# Altium schematic sheet UWB_F4_MCU.SchDoc
size A1; Organization: Altium Limited; Address1: L3, 12a Rodborough Rd; Address2: Frenchs Forest; Address3: NSW; Address4: Australia 2086
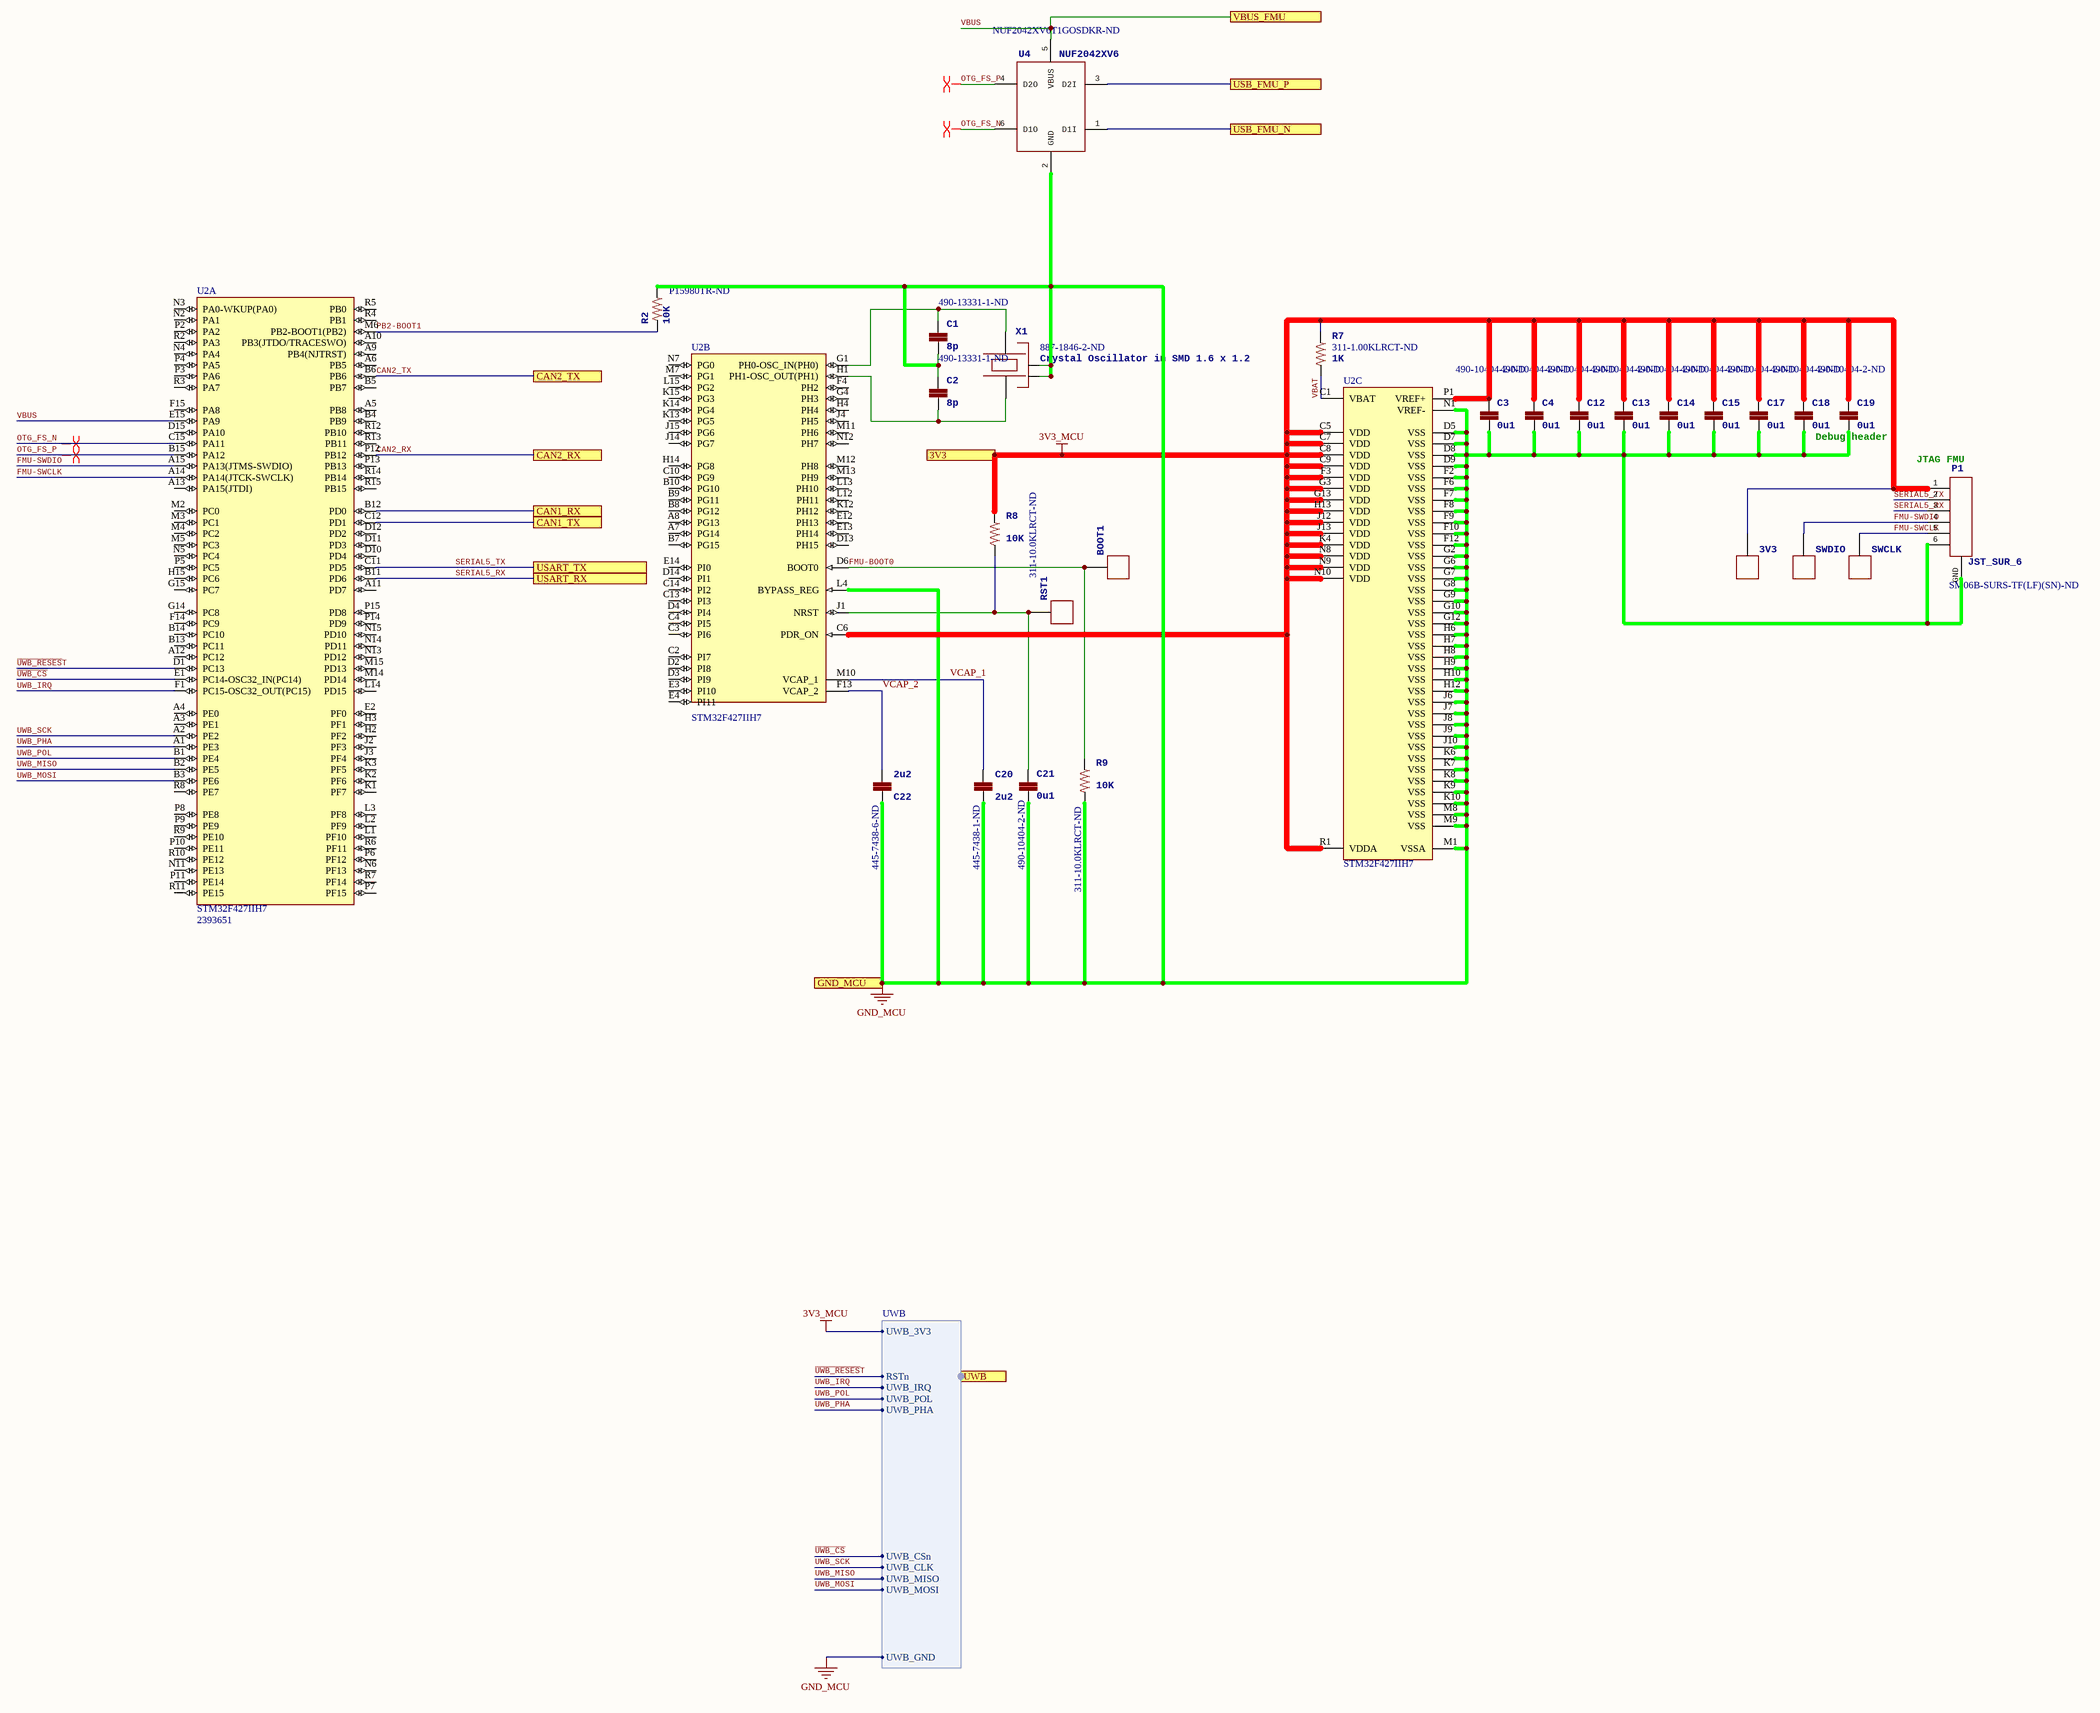
[diagram p0: UWB_F4_MCU.SchDoc]

## Parts
3V3  (no value)  [PAD.04X.04]  (no BOM)
BOOT1  (no value)  [PAD.04X.04]  (no BOM)
C1  8p  Supplier Part Number 1: 490-13331-1-ND  [0201-cap]
C2  8p  Supplier Part Number 1: 490-13331-1-ND  [0201-cap]
C3  0u1  Supplier Part Number 1: 490-10404-2-ND  [0201-cap]
C4  0u1  Supplier Part Number 1: 490-10404-2-ND  [0201-cap]
C12  0u1  Supplier Part Number 1: 490-10404-2-ND  [0201-cap]
C13  0u1  Supplier Part Number 1: 490-10404-2-ND  [0201-cap]
C14  0u1  Supplier Part Number 1: 490-10404-2-ND  [0201-cap]
C15  0u1  Supplier Part Number 1: 490-10404-2-ND  [0201-cap]
C17  0u1  Supplier Part Number 1: 490-10404-2-ND  [0201-cap]
C18  0u1  Supplier Part Number 1: 490-10404-2-ND  [0201-cap]
C19  0u1  Supplier Part Number 1: 490-10404-2-ND  [0201-cap]
C20  2u2  Supplier Part Number 1: 445-7438-1-ND  [0603-CAP]
C21  0u1  Supplier Part Number 1: 490-10404-2-ND  [0201-cap]
C22  2u2  Supplier Part Number 1: 445-7438-6-ND  [0603-CAP]
P1  JST_SUR_6  Supplier Part Number 1: SM06B-SURS-TF(LF)(SN)-ND  [JST_SUR_H6]
R2  10K  Supplier Part Number 1: P15980TR-ND  [0201-RES]
R7  1K  Supplier Part Number 1: 311-1.00KLRCT-ND  [0402-RES]
R8  10K  Supplier Part Number 1: 311-10.0KLRCT-ND  [0402-RES]
R9  10K  Supplier Part Number 1: 311-10.0KLRCT-ND  [0402-RES]
RST1  (no value)  [PAD.04X.04]  (no BOM)
SWCLK  (no value)  [PAD.04X.04]  (no BOM)
SWDIO  (no value)  [PAD.04X.04]  (no BOM)
U2  STM32F427IIH7  Supplier Part Number 1: 2393651  [STM-UFBGA176+25]  (parts A,B,C of 3)
U4  NUF2042XV6  Supplier Part Number 1: NUF2042XV6T1GOSDKR-ND  [SOT563-6]
X1  Crystal Oscillator in SMD 1.6 x 1.2  Supplier Part Number 1: 887-1846-2-ND  [OSCILLATOR-1.6x1.2]

## Ports
3V3, CAN1_RX, CAN1_TX, CAN2_RX, CAN2_TX, GND_MCU, USART_RX, USART_TX, USB_FMU_N, USB_FMU_P, UWB (harness UWB), VBUS_FMU

## Harnesses
UWB: UWB_IRQ, UWB_CLK, UWB_MISO, UWB_MOSI, UWB_CSn, UWB_POL, UWB_PHA, UWB_GND, UWB_3V3, RSTn

## Nets
3V3_MCU: 3V3.1 C3.1 C4.1 C12.1 C13.1 C14.1 C15.1 C17.1 C18.1 C19.1 P1.1 R7.2 R8.2 U2.C5(VDD) U2.C6(PDR_ON) U2.C7(VDD) U2.C8(VDD) U2.C9(VDD) U2.F3(VDD) U2.G3(VDD) U2.G13(VDD) U2.H13(VDD) U2.J12(VDD) U2.J13(VDD) U2.K4(VDD) U2.N8(VDD) U2.N9(VDD) U2.N10(VDD) U2.P1(VREF+) U2.R1(VDDA) ; port 3V3, port UWB.UWB_3V3
GND_MCU: C1.2 C2.1 C3.2 C4.2 C12.2 C13.2 C14.2 C15.2 C17.2 C18.2 C19.2 C20.2 C21.2 C22.1 P1.6 P1.GND R2.2 R9.1 U2.D5(VSS) U2.D7(VSS) U2.D8(VSS) U2.D9(VSS) U2.F2(VSS) U2.F6(VSS) U2.F7(VSS) U2.F8(VSS) U2.F9(VSS) U2.F10(VSS) U2.F12(VSS) U2.G2(VSS) U2.G6(VSS) U2.G7(VSS) U2.G8(VSS) U2.G9(VSS) U2.G10(VSS) U2.G12(VSS) U2.H6(VSS) U2.H7(VSS) U2.H8(VSS) U2.H9(VSS) U2.H10(VSS) U2.H12(VSS) U2.J6(VSS) U2.J7(VSS) U2.J8(VSS) U2.J9(VSS) U2.J10(VSS) U2.K6(VSS) U2.K7(VSS) U2.K8(VSS) U2.K9(VSS) U2.K10(VSS) U2.L4(BYPASS_REG) U2.M1(VSSA) U2.M8(VSS) U2.M9(VSS) U2.N1(VREF-) U4.2(GND) X1.2(NC_2) X1.4(NC_4) ; port GND_MCU, port UWB.UWB_GND
CAN1_RX: U2.B12(PD0) ; port CAN1_RX
CAN1_TX: U2.C12(PD1) ; port CAN1_TX
CAN2_RX: U2.P12(PB12) ; port CAN2_RX
CAN2_TX: U2.B6(PB6) ; port CAN2_TX
FMU-BOOT0: BOOT1.1 R9.2 U2.D6(BOOT0)
FMU-SWCLK: P1.5 SWCLK.1 U2.A14(PA14(JTCK-SWCLK))
FMU-SWDIO: P1.4 SWDIO.1 U2.A15(PA13(JTMS-SWDIO))
OTG_FS_N: U2.C15(PA11) U4.6(D1O)
OTG_FS_P: U2.B15(PA12) U4.4(D2O)
PB2-BOOT1: R2.1 U2.M6(PB2-BOOT1(PB2))
SERIAL5_RX: P1.3 U2.B11(PD6) ; port USART_RX
SERIAL5_TX: P1.2 U2.C11(PD5) ; port USART_TX
~{UWB_CS}: U2.E1(PC14-OSC32_IN(PC14)) ; port UWB.UWB_CSn
~{UWB_RESES}T: U2.D1(PC13) ; port UWB.RSTn
USB_FMU_N: U4.1(D1I) ; port USB_FMU_N
USB_FMU_P: U4.3(D2I) ; port USB_FMU_P
UWB_IRQ: U2.F1(PC15-OSC32_OUT(PC15)) ; port UWB.UWB_IRQ
UWB_MISO: U2.B2(PE5) ; port UWB.UWB_MISO
UWB_MOSI: U2.B3(PE6) ; port UWB.UWB_MOSI
UWB_PHA: U2.A1(PE3) ; port UWB.UWB_PHA
UWB_POL: U2.B1(PE4) ; port UWB.UWB_POL
UWB_SCK: U2.A2(PE2) ; port UWB.UWB_CLK
VBAT: R7.1 U2.C1(VBAT)
VBUS: U2.E15(PA9) U4.5(VBUS) ; port VBUS_FMU
VCAP_1: C20.1 U2.M10(VCAP_1)
VCAP_2: C22.2 U2.F13(VCAP_2)
NetC1_1: C1.1 U2.G1(PH0-OSC_IN(PH0)) X1.3
NetC2_2: C2.2 U2.H1(PH1-OSC_OUT(PH1)) X1.1
NetC21_1: C21.1 R8.1 RST1.1 U2.J1(NRST)

Not connected (* = marked no-connect by the designer): U2 A3(PE1) A4(PE0) A5(PB8) A6(PB5) A7(PG14) A8(PG13) A9(PB4(NJTRST)) A10(PB3(JTDO/TRACESWO)) A11(PD7) A12(PC12) A13(PA15(JTDI)) B4(PB9) B5(PB7) B7(PG15) B8(PG12) B9(PG11) B10(PG10) B13(PC11) B14(PC10) C2(PI7) C3(PI6) C4(PI5) C10(PG9) C13(PI3) C14(PI2) D2(PI8) D3(PI9) D4(PI4) D10(PD4) D11(PD3) D12(PD2) D13(PH15) D14(PI1) D15(PA10) E2(PF0) E3(PI10) E4(PI11) E12(PH13) E13(PH14) E14(PI0) F4(PH2) F14(PC9) F15(PA8) G4(PH3) G14(PC8) G15(PC7) H2(PF2) H3(PF1) H4(PH4) H14(PG8) H15(PC6) J2(PF3) J3(PF4) J4(PH5) J14(PG7) J15(PG6) K1(PF7) K2(PF6) K3(PF5) K12(PH12) K13(PG5) K14(PG4) K15(PG3) L1(PF10) L2(PF9) L3(PF8) L12(PH11) L13(PH10) L14(PD15) L15(PG2) M2(PC0) M3(PC1) M4(PC2) M5(PC3) M7(PG1) M11(PH6) M12(PH8) M13(PH9) M14(PD14) M15(PD13) N2(PA1) N3(PA0-WKUP(PA0)) N4(PA4) N5(PC4) N6(PF13) N7(PG0) N11(PE13) N12(PH7) N13(PD12) N14(PD11) N15(PD10) P2(PA2) P3(PA6) P4(PA5) P5(PC5) P6(PF12) P7(PF15) P8(PE8) P9(PE9) P10(PE11) P11(PE14) P13(PB13) P14(PD9) P15(PD8) R2(PA3) R3(PA7) R4(PB1) R5(PB0) R6(PF11) R7(PF14) R8(PE7) R9(PE10) R10(PE12) R11(PE15) R12(PB10) R13(PB11) R14(PB14) R15(PB15)

## Layout directives
differential pair: OTG_FS_N, OTG_FS_P

## Notes on the sheet
- Debug header
- (near P1) JTAG FMU
- Title
- Size:
- Date:
- File:
- A1
- Number:
- Time:
- Revision:
- Sheet
- of

## Library data of the parts
3V3 BOOT1 RST1 SWCLK SWDIO = PAD.04: Manufacturer 1: DNF; Supplier Unit Price 1: 0; Supplier 1: DNF; Supplier Part Number 1: DNF
C1 C2 = CAP0402: CAP CER 8PF 50V NP0 0201; Supplier 1: Digi-Key
C3 C4 C12-C15 C17-C19 C21 = CAP0402: CAP CER 0.1UF 6V Y5V 0201; Supplier 1: Digi-Key
C20 C22 = CAP0603: Supplier 1: Digi-Key
P1 = JST_SUR_6: Connector, Header, 6Pos, .8mm IDC, R/A, SMD, Tin; Supplier 1: Digi-Key
R2 = RESISTOR0402-RES: RES 10K OHM 1% 0201 SMD; Supplier 1: Digi-Key
R7-R9 = RESISTOR0402-RES: Supplier 1: Digi-Key
U2 = STM32F427IIH7: ARM Cortex-M4 32-bit MCU+FPU, 210 DMIPS, 2048 kB Flash, 256 kB Internal RAM, 140 I/Os, 176-pin UFBGA, -40 to 105 degC, Tray; Supplier 1: Farnell
U4 = NUF2042XV6: IC FILTER USB ESD PROTECT SOT363; Supplier 1: Digi-Key
X1 = OSCILLATOR-3.2X2.5: CRYSTAL 24MHZ 8PF SMD; Supplier 1: Digi-Key